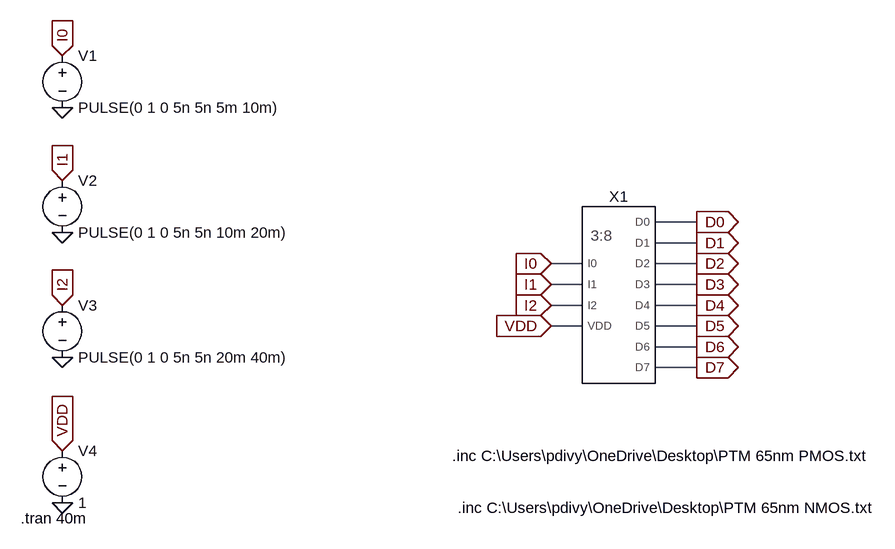
[diagram p0: schematic Draft3.asc]
Draft3.asc, the LTspice schematic file:
Version 4
SHEET 1 972 680
WIRE 320 -432 256 -432
WIRE 320 -400 256 -400
WIRE 144 -368 96 -368
WIRE 320 -368 256 -368
WIRE 144 -336 96 -336
WIRE 320 -336 256 -336
WIRE 144 -304 96 -304
WIRE 320 -304 256 -304
WIRE 144 -272 96 -272
WIRE 320 -272 256 -272
WIRE 320 -240 256 -240
WIRE 320 -208 256 -208
FLAG 96 -368 I0
IOPIN 96 -368 In
FLAG 96 -336 I1
IOPIN 96 -336 In
FLAG 96 -304 I2
IOPIN 96 -304 In
FLAG 96 -272 VDD
IOPIN 96 -272 In
FLAG 320 -432 D0
IOPIN 320 -432 Out
FLAG 320 -400 D1
IOPIN 320 -400 Out
FLAG 320 -368 D2
IOPIN 320 -368 Out
FLAG 320 -336 D3
IOPIN 320 -336 Out
FLAG 320 -304 D4
IOPIN 320 -304 Out
FLAG 320 -272 D5
IOPIN 320 -272 Out
FLAG 320 -240 D6
IOPIN 320 -240 Out
FLAG 320 -208 D7
IOPIN 320 -208 Out
FLAG -656 0 0
FLAG -656 -224 0
FLAG -656 -416 0
FLAG -656 -608 0
FLAG -656 -688 I0
IOPIN -656 -688 In
FLAG -656 -496 I1
IOPIN -656 -496 In
FLAG -656 -304 I2
IOPIN -656 -304 In
FLAG -656 -80 VDD
IOPIN -656 -80 In
SYMBOL voltage -656 -704 R0
WINDOW 123 0 0 Left 0
WINDOW 39 0 0 Left 0
SYMATTR InstName V1
SYMATTR Value PULSE(0 1 0 5n 5n 5m 10m)
SYMBOL voltage -656 -512 R0
WINDOW 123 0 0 Left 0
WINDOW 39 0 0 Left 0
SYMATTR InstName V2
SYMATTR Value PULSE(0 1 0 5n 5n 10m 20m)
SYMBOL voltage -656 -320 R0
WINDOW 123 0 0 Left 0
WINDOW 39 0 0 Left 0
SYMATTR InstName V3
SYMATTR Value PULSE(0 1 0 5n 5n 20m 40m)
SYMBOL voltage -656 -96 R0
WINDOW 123 0 0 Left 0
WINDOW 39 0 0 Left 0
SYMATTR InstName V4
SYMATTR Value 1
SYMBOL Dec3to8 192 -320 R0
SYMATTR InstName X1
TEXT -720 24 Left 2 !.tran 40m
TEXT -56 -72 Left 2 !.inc C:\\Users\\pdivy\\OneDrive\\Desktop\\PTM 65nm PMOS.txt
TEXT -48 8 Left 2 !.inc C:\\Users\\pdivy\\OneDrive\\Desktop\\PTM 65nm NMOS.txt

The netlist it stands for:
* Draft3.asc
V1 I0 0 PULSE(0 1 0 5n 5n 5m 10m)
V2 I1 0 PULSE(0 1 0 5n 5n 10m 20m)
V3 I2 0 PULSE(0 1 0 5n 5n 20m 40m)
V4 VDD 0 1
XX1 I0 I1 I2 VDD D0 D1 D2 D3 D4 D5 D6 D7 Dec3to8  ; pins I0 I1 I2 VDD D0 D1 D2 D3 D4 D5 D6 D7
.tran 40m
.inc C:\Users\pdivy\OneDrive\Desktop\PTM 65nm PMOS.txt
.inc C:\Users\pdivy\OneDrive\Desktop\PTM 65nm NMOS.txt
.backanno
.end

* Results of the author's LTspice run, read from the files saved beside the schematic
* Operating Point, zero values left out:
*   V(vdd) = 1 V
*   V(d0) = 854.4 mV
*   V(d1) = 128.7 mV
*   V(d2) = 1.244 µV
*   V(d3) = 255.6 µV
*   I(V1) = 257.4 pA
*   I(V2) = 732.1 pA
*   I(V3) = 131.5 pA
*   I(V4) = -7.608 nA
*   Ix(x1:I0) = -257.4 pA
*   Ix(x1:I1) = -732.1 pA
*   Ix(x1:I2) = -131.5 pA
*   Ix(x1:VDD) = 7.608 nA
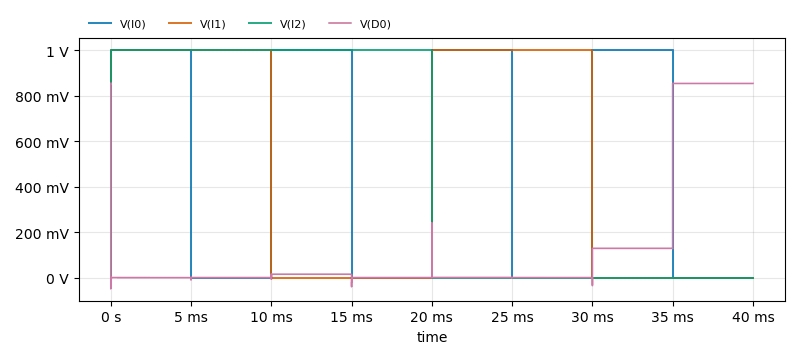
[diagram p1: Transient Analysis of Draft3.asc, plotted from the saved traces]
* Transient Analysis, 1 run:
*   V(I0): min 0 V, max 1 V, average 500 mV, rms 707.1 mV, last 0 V
*   V(I1): min 0 V, max 1 V, average 500 mV, rms 707.1 mV, last 0 V
*   V(I2): min 0 V, max 1 V, average 500 mV, rms 707.1 mV, last 0 V
*   V(D0): min -49.42 mV, max 855.6 mV, average 124.8 mV, rms 305.5 mV, last 854.4 mV